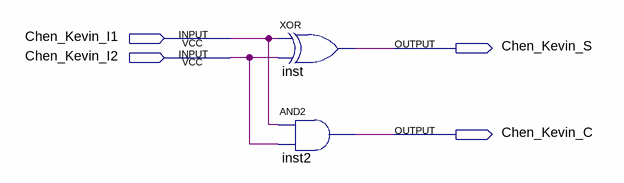
[diagram p0: schematic sheet]
// Quartus schematic Chen_Kevin_1BitHalfAdder.bdf as structural Verilog: 2 symbols, 4 pins
module Chen_Kevin_1BitHalfAdder (
  input  Chen_Kevin_I1,
  input  Chen_Kevin_I2,
  output Chen_Kevin_S,
  output Chen_Kevin_C
);

  xor inst (Chen_Kevin_S, Chen_Kevin_I1, Chen_Kevin_I2);
  and inst2 (Chen_Kevin_C, Chen_Kevin_I1, Chen_Kevin_I2);
endmodule
